# Altium schematic sheet nRF54L15_qfaa_4L_config1.SchDoc: =BoardTitle
size A4; Device: nRF54L15-QFAA; RefLayoutTitle: Reference Layout; Organization: Nordic Semiconductor; DocumentNumber: 1; SheetNumber: 1; SheetTotal: 1; CompanyName: Nordic Semiconductor; DocumentSize: A4
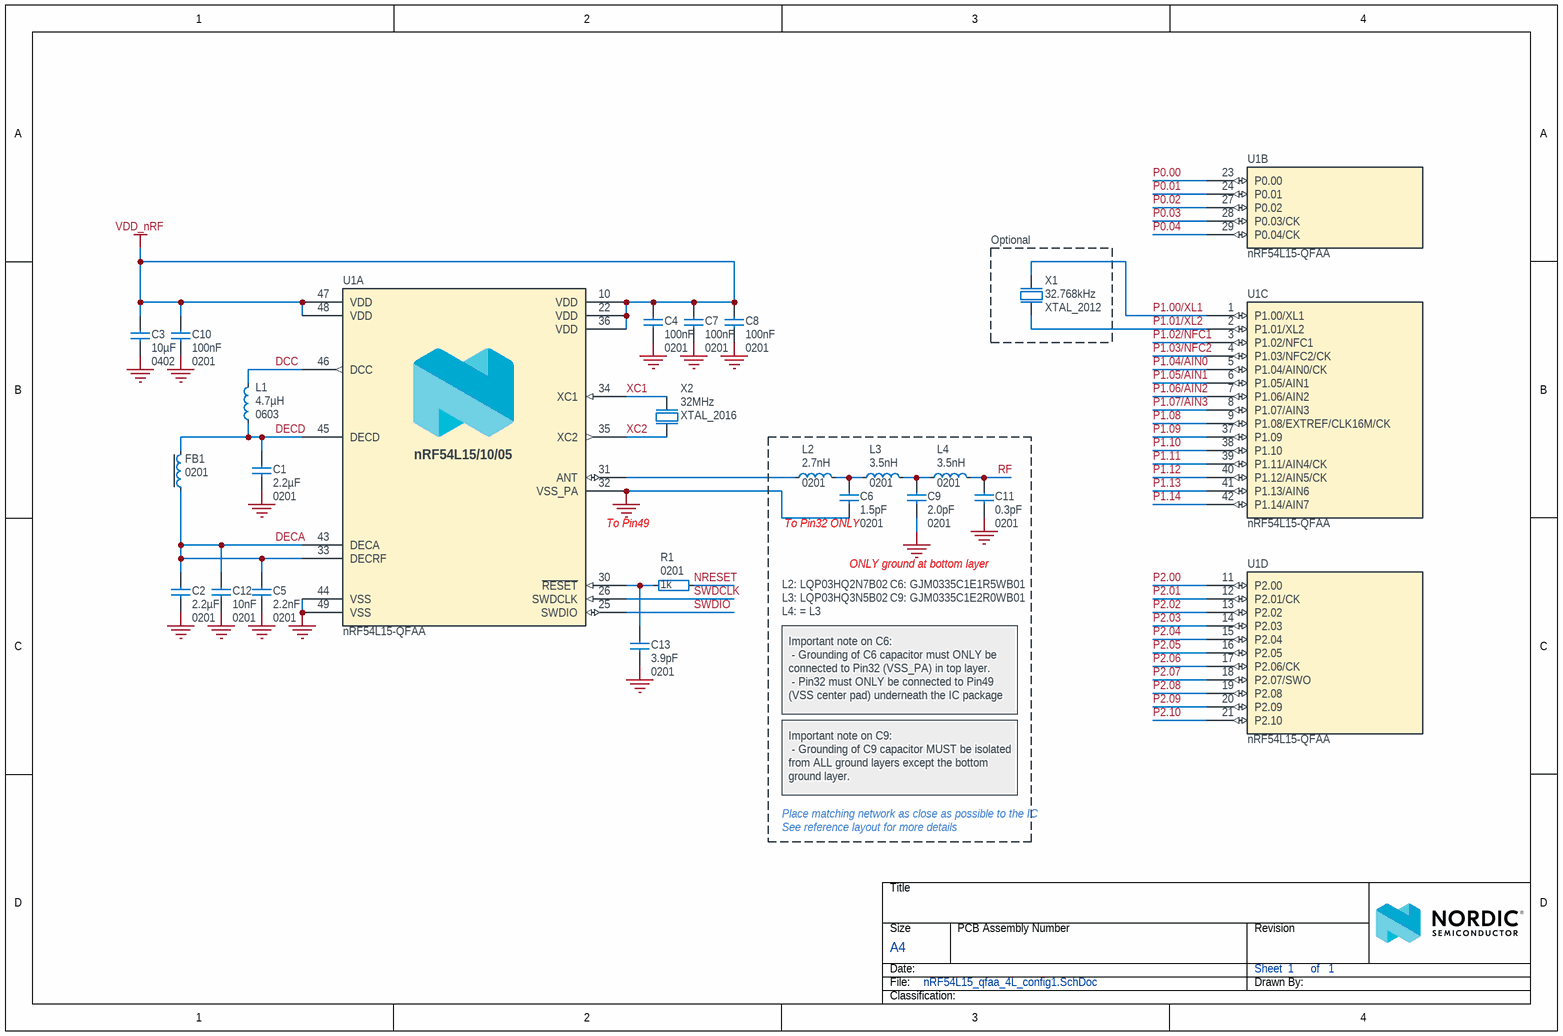
[diagram p0: nRF54L15_qfaa_4L_config1.SchDoc]

## Parts
C1  2.2µF  Footprint Doc: 0201  [CAPC0603X03L_C]
C2  2.2µF  Footprint Doc: 0201  [CAPC0603X03L_C]
C3  10µF  Footprint Doc: 0402  [CAPC1005X04L]
C4  100nF  Footprint Doc: 0201  [CAPC0603X03L_C]
C5  2.2nF  Footprint Doc: 0201  [CAPC0603X03L_C]
C6  1.5pF  Footprint Doc: 0201  [CAPC0603X03L_C]
C7  100nF  Footprint Doc: 0201  [CAPC0603X03L_C]
C8  100nF  Footprint Doc: 0201  [CAPC0603X03L_C]
C9  2.0pF  Footprint Doc: 0201  [CAPC0603X03L_C]
C10  100nF  Footprint Doc: 0201  [CAPC0603X03L_C]
C11  0.3pF  Footprint Doc: 0201  [CAPC0603X03L_C]
C12  10nF  Footprint Doc: 0201  [CAPC0603X03L_C]
C13  3.9pF  Footprint Doc: 0201  [CAPC0603X03L_C]
FB1  Footprint Doc: 0201  [INDC0603X03L_C]  (hidden comment: 120R/0.2A)
L1  4.7µH  Footprint Doc: 0603  [INDC1608X06L]
L2  2.7nH  Footprint Doc: 0201  [INDC0603X03L_C]
L3  3.5nH  Footprint Doc: 0201  [INDC0603X03L_C]
L4  3.5nH  Footprint Doc: 0201  [INDC0603X03L_C]
R1  1k  Footprint Doc: 0201  [RESC0603X03L_C]
U1  nRF54L15-QFAA  [QFN40P600X600X90-48N]  (parts A,B,C,D of 4)
X1  32.768kHz  [XTAL_2012]
X2  32MHz  Footprint Doc: XTAL_2016  [BT-XTAL_2016]

## Blocks framed on the sheet
Optional: X1

## Nets
GND: C1.1 C2.1 C3.1 C4.2 C5.1 C6.1 C7.2 C8.2 C9.1 C10.2 C11.1 C12.1 C13.1 U1.32(VSS_PA) U1.44(VSS) U1.49(VSS) X2.2(GND) X2.4(GND)
VDD_nRF: C3.2 C4.1 C7.1 C8.1 C10.1 U1.10(VDD) U1.22(VDD) U1.36(VDD) U1.47(VDD) U1.48(VDD)
DCC: L1.1 U1.46(DCC)
DECA: C2.2 C5.2 C12.2 FB1.2 U1.33(DECRF) U1.43(DECA)
DECD: C1.2 FB1.1 L1.2 U1.45(DECD)
NRESET: R1.2
P0.00: U1.23(P0.00)
P0.01: U1.24(P0.01)
P0.02: U1.27(P0.02)
P0.03: U1.28(P0.03/CK)
P0.04: U1.29(P0.04/CK)
P1.00/XL1: U1.1(P1.00/XL1) X1.2(out)
P1.01/XL2: U1.2(P1.01/XL2) X1.1(inp)
P1.02/NFC1: U1.3(P1.02/NFC1)
P1.03/NFC2: U1.4(P1.03/NFC2/CK)
P1.04/AIN0: U1.5(P1.04/AIN0/CK)
P1.05/AIN1: U1.6(P1.05/AIN1)
P1.06/AIN2: U1.7(P1.06/AIN2)
P1.07/AIN3: U1.8(P1.07/AIN3)
P1.08: U1.9(P1.08/EXTREF/CLK16M/CK)
P1.09: U1.37(P1.09)
P1.10: U1.38(P1.10)
P1.11: U1.39(P1.11/AIN4/CK)
P1.12: U1.40(P1.12/AIN5/CK)
P1.13: U1.41(P1.13/AIN6)
P1.14: U1.42(P1.14/AIN7)
P2.00: U1.11(P2.00)
P2.01: U1.12(P2.01/CK)
P2.02: U1.13(P2.02)
P2.03: U1.14(P2.03)
P2.04: U1.15(P2.04)
P2.05: U1.16(P2.05)
P2.06: U1.17(P2.06/CK)
P2.07: U1.18(P2.07/SWO)
P2.08: U1.19(P2.08)
P2.09: U1.20(P2.09)
P2.10: U1.21(P2.10)
RF: C11.2 L4.2
SWDCLK: U1.26(SWDCLK)
SWDIO: U1.25(SWDIO)
XC1: U1.34(XC1) X2.1(inp)
XC2: U1.35(XC2) X2.3(out)
NetC6_2: C6.2 L2.2 L3.1
NetC9_2: C9.2 L3.2 L4.1
NetC13_2: C13.2 R1.1 U1.30(~{RESET})
NetL2_1: L2.1 U1.31(ANT)

## Notes on the sheet
- (near U1) To Pin49
- (near C6) To Pin32 ONLY
- ONLY ground at bottom layer
- L2: LQP03HQ2N7B02
- L3: LQP03HQ3N5B02
- L4: = L3
- C6: GJM0335C1E1R5WB01
- C9: GJM0335C1E2R0WB01
- Important note on C6:
  - Grounding of C6 capacitor must ONLY be connected to Pin32 (VSS_PA) in top layer.
  - Pin32 must ONLY be connected to Pin49 (VSS center pad) underneath the IC package
- Important note on C9:
  - Grounding of C9 capacitor MUST be isolated from ALL ground layers except the bottom ground layer.
- See reference layout for more details
- Place matching network as close as possible to the IC
- Title
- Size
- Date:
- File:
- A4
- PCB Assembly Number
- Sheet         of
- Drawn By:
- Revision
- Classification:
- (in symbol nRF54L15-QFAA, part A) nRF54L15/10/05

## Library data of the parts
C1 C2 = C0201-2µ2-2.5V-X6T-GRM033D80E225ME47D: Capacitor, Ceramic, 2.2µF 2.5V X6T 0201,±20%; Manufacturer: Murata; Manufacturer Part Number: GRM033R61A225KE47; Part number NEMS: 100200527; Component Status: Active; Pad Count: 2; Note: 2.5V, 20%, X6T; Artikkelnr Noca: N.A.; Part Number: C0201-2µ2-2.5V-X6T-GRM033D80E225ME47D; Component Class: Capacitors; Author: stl1; ComponentLink1URL: https://www.murata.com/products/productdetail?partno=GRM033D80E225ME47%23; ComponentLink1Description: Datasheet; ComponentLink2URL: N.A.; ComponentLink2Description: Supplier link; HelpURL: N.A.; LatestRevisionDate: 2022-02-27; Published: 2022-02-27; Value: 2.2µF; Supplier 1: Mouser; Supplier Part Number 1: 81-GRM033D80E225ME7D; Supplier 2: Digi-Key; Supplier Part Number 2: 490-18653-1-ND; Part number IPS: N.A.; Part number Norautron: N.A.; PartId: 100200527
C3 = C0402-10µF-6.3V-X6S: Capacitor, X6S, ±20%, 6.3V; Manufacturer: N.A.; Part number NEMS: 100200478; Component Status: Active; Pad Count: 2; Part Number: C0402-10µF-6.3V-X6S; PartId: 100200478; Component Class: Capacitors; Author: getr; Manufacturer Part Number: N.A.; ComponentLink1URL: N.A.; ComponentLink1Description: Datasheet; ComponentLink2URL: N.A.; ComponentLink2Description: Supplier link; HelpURL: N.A.; LatestRevisionDate: 2021-06-25; Published: 2021-06-25; Value: 10µF; Note: 6.3V; Supplier 1: N.A.; Supplier Part Number 1: N.A.; Supplier 2: N.A.; Supplier Part Number 2: N.A.; Artikkelnr Noca: N.A.; Part number IPS: N.A.; Part number Norautron: N.A.
C4 C7 C8 C10 = C0201-100n-10V-X7R: Capacitor, X7R, ±10%; Manufacturer: N.A.; Part number NEMS: 100200469; Note: 10V; Pad Count: 2; Component Status: Active; Part Number: C0201-100n-10V-X7R; Manufacturer Part Number: N.A.; LatestRevisionDate: 2021-04-12; Published: 2021-04-12; Value: 100nF; Artikkelnr Noca: N.A.; Part number IPS: N.A.; ComponentLink1URL: N.A.; ComponentLink1Description: Datasheet; ComponentLink2URL: N.A.; ComponentLink2Description: Supplier link; HelpURL: N.A.; Supplier 1: N.A.; Supplier Part Number 1: N.A.; Supplier 2: N.A.; Supplier Part Number 2: N.A.; Component Class: Capacitors; Author: getr; Part number Norautron: N.A.; PartId: 100200469
C5 = C0201-2n2: Capacitor, X7R, ±10%, 10V; Manufacturer: N.A.; Part number IPS: 00000001778; Part number Norautron: 26470002; Part number NEMS: 100200060; Component Status: Active; Pad Count: 2; Part Number: C0201-2n2; PartId: 100200060; Component Class: Capacitors; Author: rsk; Manufacturer Part Number: N.A.; ComponentLink1URL: N.A.; ComponentLink1Description: Datasheet; ComponentLink2URL: N.A.; ComponentLink2Description: Supplier link; HelpURL: N.A.; LatestRevisionDate: 2014-11-13; Published: 2014-11-13; Value: 2.2nF; Note: 10V; Supplier 1: N.A.; Supplier Part Number 1: N.A.; Supplier 2: N.A.; Supplier Part Number 2: N.A.; Artikkelnr Noca: N.A.
C6 = C0201-1.5p-25V-NP0-GJM0335C1E1R5WB01: Capacitor, NP0, ±0.05pF, 25V, High Q; Manufacturer: Murata; Part number NEMS: 100200477; Component Status: Active; Pad Count: 2; Artikkelnr Noca: N.A.; Part Number: C0201-1.5p-25V-NP0-GJM0335C1E1R5WB01; PartId: 100200477; Component Class: Capacitors; Author: masi; Manufacturer Part Number: GJM0335C1E1R5WB01; ComponentLink1URL: https://search.murata.co.jp/Ceramy/image/img/A01X/G101/ENG/GJM0335C1E1R5WB01-01.pdf; ComponentLink1Description: Datasheet; ComponentLink2URL: N.A.; ComponentLink2Description: Supplier link; HelpURL: https://www.murata.com/products/productdetail?partno=GJM0335C1E1R5WB01%23; LatestRevisionDate: 2021-06-15; Published: 2021-06-15; Value: 1.5pF; Note: 25V; Supplier 1: Digi-Key; Supplier Part Number 1: 490-11176-2-ND; Supplier 2: Mouser; Supplier Part Number 2: 81-GJM0335C1E1R5WB1D; Part number IPS: N.A.; Part number Norautron: N.A.
C9 = C0201-2.0p-HQ-Murata: Capacitor, NP0, ±0.05pF, 25V; Manufacturer: Murata; Manufacturer Part Number: GJM0335C1E2R0WB01; Part number IPS: 00000001775; Part number NEMS: 100200419; Component Status: Active; Pad Count: 2; Artikkelnr Noca: N.A.; Part Number: C0201-2.0p-HQ-Murata; PartId: 100200419; Component Class: Capacitors; Author: rsk; ComponentLink1URL: N.A.; ComponentLink1Description: Datasheet; ComponentLink2URL: N.A.; ComponentLink2Description: Supplier link; HelpURL: https://psearch.en.murata.com/capacitor/product/GJM0335C1E2R0WB01%23.html; LatestRevisionDate: 2018-10-25; Published: 2018-10-25; Value: 2.0pF; Note: 25V; Supplier 1: N.A.; Supplier Part Number 1: N.A.; Supplier 2: N.A.; Supplier Part Number 2: N.A.; Part number Norautron: N.A.
C11 = C0201-0.3p-50V-GRM0335C1HR30BA01: Capacitor, C0G, ±0.1pF, 50V; Manufacturer: Murata; Part number NEMS: 100200650; Component Status: Active; Pad Count: 2; Artikkelnr Noca: N.A.; Part Number: C0201-0.3p-50V-GRM0335C1HR30BA01; PartId: 100200650; Component Class: Capacitors; Author: masi; Manufacturer Part Number: GRM0335C1HR30BA01; ComponentLink1URL: https://www.murata.com/en-global/products/productdetail?partno=GRM0335C1HR30BA01%23; ComponentLink1Description: Datasheet; ComponentLink2URL: N.A.; ComponentLink2Description: Supplier link; HelpURL: N.A.; LatestRevisionDate: 2024-01-10; Published: 2024-01-10; Value: 0.3pF; Note: 50V; Supplier 1: Digi-Key; Supplier Part Number 1: 490-6135-2-ND; Supplier 2: Mouser; Supplier Part Number 2: 81-GRM0335C1HR30BA1D; Part number IPS: N.A.; Part number Norautron: N.A.
C12 = C0201-10n-6.3V-X7R: Capacitor, X7R, 6.3V; Manufacturer: Murata; Manufacturer Part Number: GRM033R70J103KA01D; Part number NEMS: 100200407; Component Status: Active; Pad Count: 2; Artikkelnr Noca: N.A.; Part Number: C0201-10n-6.3V-X7R; PartId: 100200407; Component Class: Capacitors; Author: rsk; ComponentLink1URL: http://search.murata.co.jp/Ceramy/image/img/A01X/G101/ENG/GRM033R70J103KA01-01.pdf; ComponentLink1Description: Datasheet; ComponentLink2URL: N.A.; ComponentLink2Description: Supplier link; HelpURL: N.A.; LatestRevisionDate: 2020-10-13; Published: 2018-05-07; Value: 10nF; Note: 6.3V; Supplier 1: Digi-Key; Supplier Part Number 1: 490-1262-1-ND; Supplier 2: N.A.; Supplier Part Number 2: N.A.; Part number IPS: N.A.; Part number Norautron: N.A.
C13 = C0201-3.9p: Chip Cap 0201; Manufacturer: N.A.; Part number NEMS: 100200024; Component Status: Active; Pad Count: 2; Note: Chip Cap 1%; Part Number: C0201-3.9p; PartId: 100200024; Component Class: Capacitors; Author: rsk; Manufacturer Part Number: N.A.; ComponentLink1URL: N.A.; ComponentLink1Description: Datasheet; ComponentLink2URL: N.A.; ComponentLink2Description: Supplier link; HelpURL: N.A.; LatestRevisionDate: 2014-11-13; Published: 2014-11-13; Value: 3.9pF; Supplier 1: N.A.; Supplier Part Number 1: N.A.; Supplier 2: N.A.; Supplier Part Number 2: N.A.; Artikkelnr Noca: N.A.; Part number IPS: N.A.; Part number Norautron: N.A.
FB1 = FB0201-120R@100M-200mA-BLM03AG121SN1D: Ferrite Bead, 120 Ohm @ 100MHz, 200mA, 500 mOhm Max; Manufacturer: Murata; Part number NEMS: 100300419; Component Status: Active; Pad Count: 2; Artikkelnr Noca: N.A.; Part Number: FB0201-120R@100M-200mA-BLM03AG121SN1D; Component Class: Inductors; Author: stl1; Manufacturer Part Number: BLM03AG121SN1D; ComponentLink1URL: https://www.murata.com/en-eu/products/productdetail?partno=BLM03AG121SN1%23; ComponentLink1Description: Datasheet; ComponentLink2URL: N.A.; ComponentLink2Description: Supplier link; HelpURL: N.A.; LatestRevisionDate: 2022-02-27; Published: 2022-02-27; Value: 120R/0.2A; Note: Ferrite Bead; Supplier 1: Digi-Key; Supplier Part Number 1: 490-5622-1-ND; Supplier 2: Mouser; Supplier Part Number 2: 81-BLM03AX121SN1D; Part number IPS: N.A.; Part number Norautron: N.A.; PartId: 100300419
L1 = L0603-4µ7-MLZ1608M4R7WT000: Inductor, 120mA, ±20%, 0.65R; Manufacturer: TDK Corporation; Part number NEMS: 100300440; Component Status: Active; Pad Count: 2; Note: Power Inductor ±20%; Artikkelnr Noca: N.A.; Part Number: L0603-4µ7-MLZ1608M4R7WT000; PartId: 100300440; Component Class: Inductors; Author: stl1; Manufacturer Part Number: MLZ1608M4R7WT000; ComponentLink1URL: https://product.tdk.com/en/search/inductor/inductor/smd/info?part_no=MLZ1608M4R7WT000; ComponentLink1Description: Datasheet; ComponentLink2URL: N.A.; ComponentLink2Description: Supplier link; HelpURL: N.A.; LatestRevisionDate: 2023-05-10; Published: 2023-05-10; Value: 4.7µH; Supplier 1: Digi-Key; Supplier Part Number 1: 445-6390-2-ND; Supplier 2: Mouser; Supplier Part Number 2: 810-MLZ1608M4R7WT000; Part number IPS: N.A.; Part number Norautron: N.A.
L2 = L0201-2n7-HQ-Murata: Inductor, 600mA, ±0.1ｎH, 120mOhm; Manufacturer: Murata; Manufacturer Part Number: LQP03HQ2N7B02; Part number IPS: 00000001753; Part number NEMS: 100300214; Component Status: Active; Pad Count: 2; Note: -55°C ~ 125°C; Artikkelnr Noca: N.A.; Part Number: L0201-2n7-HQ-Murata; PartId: 100300214; Component Class: Inductors; Author: rsk; ComponentLink1URL: https://search.murata.co.jp/Ceramy/image/img/P02/JELF243C-0021.pdf; ComponentLink1Description: Datasheet; ComponentLink2URL: N.A.; ComponentLink2Description: Supplier link; HelpURL: https://psearch.en.murata.com/inductor/product/LQP03HQ2N7B02%23.html; LatestRevisionDate: 2018-10-23; Published: 2018-10-23; Value: 2.7nH; Supplier 1: Digi-Key; Supplier Part Number 1: 490-13909-1-ND; Supplier 2: N.A.; Supplier Part Number 2: N.A.; Part number Norautron: N.A.
L3 L4 = L0201-3n5-HQ-Murata: Inductor, 500mA, ±0.1ｎH, 170mOhm; Manufacturer: Murata; Manufacturer Part Number: LQP03HQ3N5B02; Part number NEMS: 100300222; Component Status: Active; Pad Count: 2; Note: -55°C ~ 125°C; Artikkelnr Noca: N.A.; Part Number: L0201-3n5-HQ-Murata; PartId: 100300222; Component Class: Inductors; Author: rsk; ComponentLink1URL: https://search.murata.co.jp/Ceramy/image/img/P02/JELF243C-0021.pdf; ComponentLink1Description: Datasheet; ComponentLink2URL: N.A.; ComponentLink2Description: Supplier link; HelpURL: https://psearch.en.murata.com/inductor/product/LQP03HQ3N5B02%23.html; LatestRevisionDate: 2018-10-23; Published: 2018-10-23; Value: 3.5nH; Supplier 1: Digi-Key; Supplier Part Number 1: 490-13925-1-ND; Supplier 2: N.A.; Supplier Part Number 2: N.A.; Part number IPS: N.A.; Part number Norautron: N.A.
R1 = R0201-1k0: Resistor, ±1%, 0.05W; Manufacturer: N.A.; Part number IPS: 00000005786; Part number NEMS: 100100043; Component Status: Active; Pad Count: 2; Note: Chip Res 1%; Part Number: R0201-1k0; PartId: 100100043; Component Class: Resistors; Author: rsk; Manufacturer Part Number: N.A.; ComponentLink1URL: N.A.; ComponentLink1Description: Datasheet; ComponentLink2URL: N.A.; ComponentLink2Description: Supplier link; HelpURL: N.A.; LatestRevisionDate: 2014-11-13; Published: 2014-11-13; Value: 1k; Supplier 1: N.A.; Supplier Part Number 1: N.A.; Supplier 2: N.A.; Supplier Part Number 2: N.A.; Artikkelnr Noca: N.A.; Part number Norautron: N.A.
U1 = nRF54L15-QFAA: Multi-protocol Bluetooth Low Energy, IEEE 802.15.4 and 2.4GHz proprietary Wireless MCU; Manufacturer: Nordic Semiconductor; Part number NEMS: 102000370; Component Status: Active; Pad Count: 49; Note: N.A.; Part Number: nRF54L15-QFAA; PartId: 102000370; Component Class: Nordic_Devices; Author: stl1; Manufacturer Part Number: nRF54L15-QFAA; ComponentLink1URL: N.A.; ComponentLink1Description: Datasheet; ComponentLink2URL: N.A.; ComponentLink2Description: Supplier link; HelpURL: N.A.; LatestRevisionDate: 2024-11-27; Published: 2024-11-27; Footprint Doc: QFN-48; Value: nRF54L15-QFAA; Supplier 1: Nordic Semiconductor; Supplier Part Number 1: nRF54L15-QFAA; Supplier 2: N.A.; Supplier Part Number 2: N.A.; Artikkelnr Noca: N.A.; Part number IPS: N.A.; Part number Norautron: N.A.
X1 = XTAL_SMD2012_32.768kHz_9pF_TXC: XTAL SMD 2012, 32.768kHz, 9pF, ±20ppm; Manufacturer: TXC Corporation; Manufacturer Part Number: 9HT11-32.768KDZC-T; Part number NEMS: 101600107; Component Status: Active; Pad Count: 2; Note: XTAL SMD 32.768kHz; Artikkelnr Noca: N.A.; Part Number: XTAL_SMD2012_32.768kHz_9pF_TXC; PartId: 101600107; Component Class: Oscillators; Author: eisk; ComponentLink1URL: http://www.txccrystal.com/images/pdf/9ht11.pdf; ComponentLink1Description: Datasheet; ComponentLink2URL: https://www.digikey.com/en/products/detail/9HT11-32.768KDZC-T/887-1426-1-ND/2403277; ComponentLink2Description: Supplier link; HelpURL: http://www.txccrystal.com/images/pdf/9ht11.pdf; LatestRevisionDate: 2023-03-14; Published: 2014-03-28; Footprint Doc: XTAL_2012; Value: 32.768kHz; Supplier 1: Digi-Key; Supplier Part Number 1: 887-1426-2-ND; Supplier 2: Mouser; Supplier Part Number 2: 717-9HT11-32.7KDZC-T; Part number IPS: N.A.; Part number Norautron: N.A.
X2 = XTAL_SMD2016_32MHz_8pF_Kyocera: XTAL SMD 2016, 32MHz, Cl=8pF, Tot: ±40ppm; Manufacturer Part Number: CX2016DB32000D0WZRC1; Part number IPS: 00000007827; Part number Norautron: 26511136; Part number NEMS: 101600039; Component Status: Active; Pad Count: 4; Note: XTAL SMD 32.000MHz; Artikkelnr Noca: 22010022; Part Number: XTAL_SMD2016_32MHz_8pF_Kyocera; PartId: 101600039; Component Class: Oscillators; Author: rsk; Manufacturer: Kyocera; ComponentLink1URL: N.A.; ComponentLink1Description: Datasheet; ComponentLink2URL: N.A.; ComponentLink2Description: Supplier link; HelpURL: http://media.digikey.com/pdf/Data%20Sheets/AVX%20PDFs/CX2016DB32000D0WZRC1_Spec.pdf; LatestRevisionDate: 2016-06-02; Published: 2015-10-15; Value: 32MHz; Supplier 1: Digi-Key; Supplier Part Number 1: 1253-1586-1-ND; Supplier 2: N.A.; Supplier Part Number 2: N.A.